# Altium schematic sheet Mach chinh STM32F103.SchDoc
size A; SheetNumber: 1; SheetTotal: 1
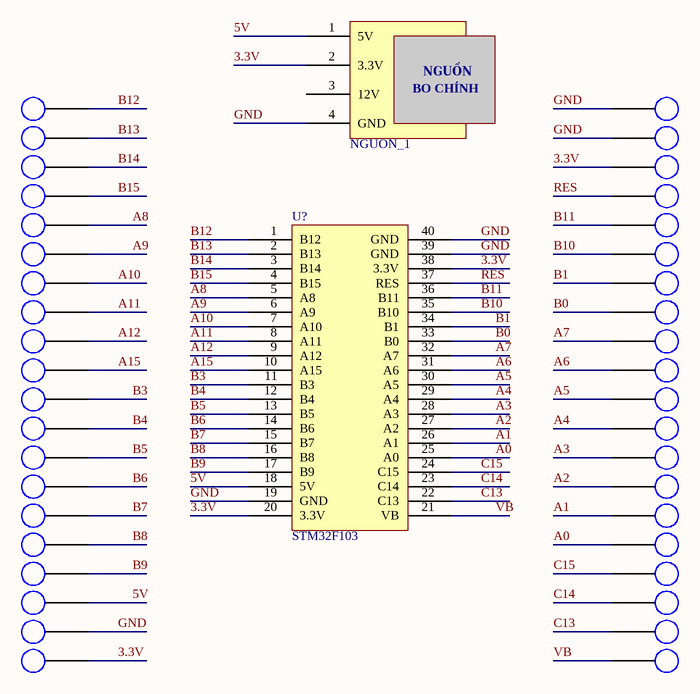
[diagram p0: Mach chinh STM32F103.SchDoc]

## Parts
*  NGUON_1  [NGUON_1]
P1  PIN  [PIN1]  (value not drawn)
P2  PIN  [PIN1]  (value not drawn)
P3  PIN  [PIN1]  (value not drawn)
P4  PIN  [PIN1]  (value not drawn)
P5  PIN  [PIN1]  (value not drawn)
P6  PIN  [PIN1]  (value not drawn)
P7  PIN  [PIN1]  (value not drawn)
P8  PIN  [PIN1]  (value not drawn)
P9  PIN  [PIN1]  (value not drawn)
P10  PIN  [PIN1]  (value not drawn)
P11  PIN  [PIN1]  (value not drawn)
P12  PIN  [PIN1]  (value not drawn)
P13  PIN  [PIN1]  (value not drawn)
P14  PIN  [PIN1]  (value not drawn)
P15  PIN  [PIN1]  (value not drawn)
P16  PIN  [PIN1]  (value not drawn)
P17  PIN  [PIN1]  (value not drawn)
P18  PIN  [PIN1]  (value not drawn)
P19  PIN  [PIN1]  (value not drawn)
P20  PIN  [PIN1]  (value not drawn)
P21  PIN  [PIN1]  (value not drawn)
P22  PIN  [PIN1]  (value not drawn)
P23  PIN  [PIN1]  (value not drawn)
P24  PIN  [PIN1]  (value not drawn)
P25  PIN  [PIN1]  (value not drawn)
P26  PIN  [PIN1]  (value not drawn)
P27  PIN  [PIN1]  (value not drawn)
P28  PIN  [PIN1]  (value not drawn)
P29  PIN  [PIN1]  (value not drawn)
P30  PIN  [PIN1]  (value not drawn)
P31  PIN  [PIN1]  (value not drawn)
P32  PIN  [PIN1]  (value not drawn)
P33  PIN  [PIN1]  (value not drawn)
P34  PIN  [PIN1]  (value not drawn)
P35  PIN  [PIN1]  (value not drawn)
P36  PIN  [PIN1]  (value not drawn)
P37  PIN  [PIN1]  (value not drawn)
P38  PIN  [PIN1]  (value not drawn)
P39  PIN  [PIN1]  (value not drawn)
P40  PIN  [PIN1]  (value not drawn)
U?  STM32F103  [STM32F103_KC]

## Nets
3.3V: *.2(3.3V) P20.1 P23.1 U?.20(3.3V) U?.38(3.3V)
5V: *.1(5V) P18.1 U?.18(5V)
A0: P36.1 U?.25(A0)
A1: P35.1 U?.26(A1)
A2: P34.1 U?.27(A2)
A3: P33.1 U?.28(A3)
A4: P32.1 U?.29(A4)
A5: P31.1 U?.30(A5)
A6: P30.1 U?.31(A6)
A7: P29.1 U?.32(A7)
A8: P5.1 U?.5(A8)
A9: P6.1 U?.6(A9)
A10: P7.1 U?.7(A10)
A11: P8.1 U?.8(A11)
A12: P9.1 U?.9(A12)
A15: P10.1 U?.10(A15)
B0: P28.1 U?.33(B0)
B1: P27.1 U?.34(B1)
B3: P11.1 U?.11(B3)
B4: P12.1 U?.12(B4)
B5: P13.1 U?.13(B5)
B6: P14.1 U?.14(B6)
B7: P15.1 U?.15(B7)
B8: P16.1 U?.16(B8)
B9: P17.1 U?.17(B9)
B10: P26.1 U?.35(B10)
B11: P25.1 U?.36(B11)
B12: P1.1 U?.1(B12)
B13: P2.1 U?.2(B13)
B14: P3.1 U?.3(B14)
B15: P4.1 U?.4(B15)
C13: P39.1 U?.22(C13)
C14: P38.1 U?.23(C14)
C15: P37.1 U?.24(C15)
GND: *.4(GND) P19.1 P21.1 P22.1 U?.19(GND) U?.39(GND) U?.40(GND)
RES: P24.1 U?.37(RES)
VB: P40.1 U?.21(VB)

Not connected (* = marked no-connect by the designer): * 3(12V)

## Notes on the sheet
- (in symbol NGUON_1) NGUỒN; BO CHÍNH